# EAGLE design WiFiHumi (EAGLE 7.2.0)
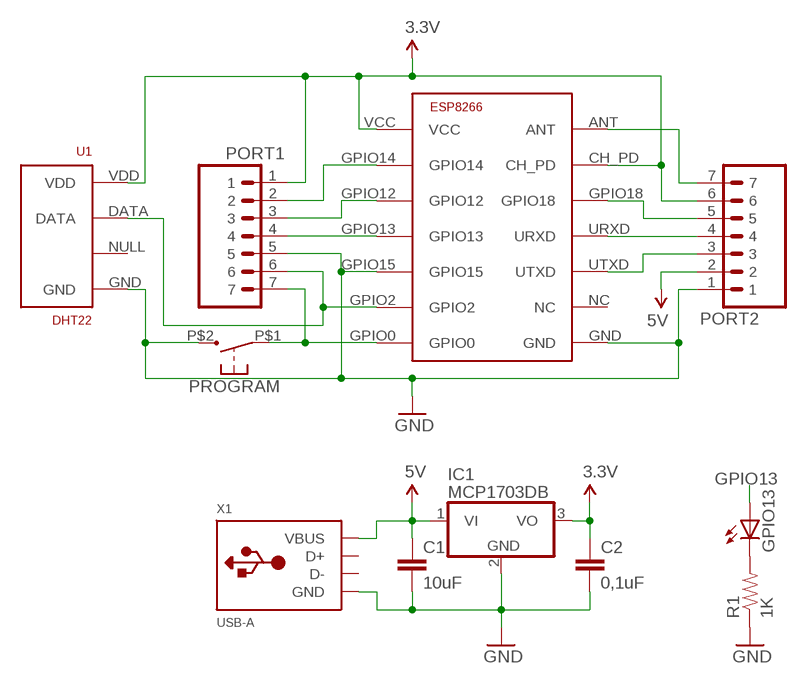
[diagram p0: schematic, sheet 1]

## Parts
C1  10uF  CAP0603-CAP  [0603-CAP]
C2  0,1uF  CAP0603-CAP  [0603-CAP]
GPIO13  LEDCHIPLED_0603  [CHIPLED_0603]
IC1  MCP1703DB  [SOT223]
PORT1  DIPLOCK7-FEMALE  [1X07_FEMALE_LOCK.010]
PORT2  DIPLOCK7-FEMALE  [1X07_FEMALE_LOCK.010]
PROGRAM  OMRON_B3U-1000_TACT_SW  [BC3-1000]
R1  1K  RESISTOR0603-RES  [0603-RES]
U1  DHT22  RHT03_DHT-22_AM2302RA  [RHT03_DHT-22/RA]
U$1  ESP8266  [ESP-03]
X1  USB-A  [MOLEX_480371000]

## Nets
3.3V: C2.1 IC1.3(VO) PORT1.1 PORT2.6 U1.VDD U$1.CH_PD U$1.VCC
5V: C1.1 IC1.1(VI) PORT2.2 X1.1(VBUS)
ANT: PORT2.7 U$1.ANT
GND: C1.2 C2.2 IC1.2(GND) PORT1.5 PORT2.1 PROGRAM.P$2 R1.1 U1.GND U$1.GND U$1.GPIO15 X1.4(GND)
GPIO0: PORT1.7 PROGRAM.P$1 U$1.GPIO0
GPIO02: PORT1.6 U1.DATA U$1.GPIO2
GPIO12: PORT1.3 U$1.GPIO12
GPIO13: GPIO13.A PORT1.4 U$1.GPIO13
GPIO14: PORT1.2 U$1.GPIO14
GPIO18: PORT2.5 U$1.GPIO18
N$1: GPIO13.C R1.2
RXD: PORT2.4 U$1.URXD
TXD: PORT2.3 U$1.UTXD
Unconnected: U1.NULL U$1.NC X1.2(D-) X1.3(D+)

## Library data of the parts
C1 C2 = SparkFun:CAP: Capacitor Standard 0603 ceramic capacitor, and 0.1" leaded capacitor.
GPIO13 = adafruit:LED: LED OSRAM: - CHIPLED LG R971, LG N971, LY N971, LG Q971, LY Q971, LO R971, LY R971 LH N974, LH R974 LS Q976, LO Q976, LY Q976 LO Q996 - Hyper CHIPLED LW Q18S LB Q993, LB Q99A, LB R99A - SideLED LS A670, LO A670, LY A670, LG A670, LP A670 LB A673, LV A673, LT A673, LW A673 LH A674 LY A675 LS A676, LA A676, LO A676, LY A676, LW A676 LS A679, LY A679, LG A679 - Hyper Micro SIDELED® LS Y876, LA Y876, LO Y876, LY Y876 LT Y87S - SmartLED LW L88C, LW L88S LB L89C, LB L89S, LG L890 LS L89K, LO L89K, LY L89K LS L896, LA L896, LO L896, LY L896 - TOPLED LS T670, LO T670, LY T670, LG T670, LP T670 LSG T670, LSP T670, LSY T670, LOP T670, LYG T670 LG T671, LOG T671, LSG T671 LB T673, LV T673, LT T673, LW T673 LH T674 LS T676, LA T676, LO T676, LY T676, LB T676, LH T676, LSB T676, LW T676 LB T67C, LV T67C, LT T67C, LS T67K, LO T67K, LY T67K, LW E67C LS E67B, LA E67B, LO E67B, LY E67B, LB E67C, LV E67C, LT E67C LW T67C LS T679, LY T679, LG T679 LS T770, LO T770, LY T770, LG T770, LP T770 LB T773, LV T773, LT T773, LW T773 LH T774 LS E675, LA E675, LY E675, LS T675 LS T776, LA T776, LO T776, LY T776, LB T776 LHGB T686 LT T68C, LB T68C - Hyper Mini TOPLED® LB M676 - Mini TOPLED Santana® LG M470 LS M47K, LO M47K, LY M47K Source: http://www.osram.convergy.de/
IC1 = linear:MCP1703: 250 mA, 16V, Low Quiescent Current LDO Regulator Source: http://ww1.microchip.com/downloads/en/DeviceDoc/22049b.pdf
PORT1 PORT2 = LockHeader:DIPLOCK7: PIN HEADER
PROGRAM = ModernDevice:OMRON_B3U-1000_TACT_SW
R1 = SparkFun:RESISTOR: Resistor Basic schematic elements and footprints for 0603, 1206, and PTH resistors.
U1 = RHT03_DHT-22_AM2302:RHT03_DHT-22_AM2302: RHT03 / DHT-22 / AM2302 Packages and symbol for the RHT03 / DHT-22 relative humidity and temperature sensor. Note: The AM2302 is a wired version of the DHT-22 which typically requires less clearance and is thus provided as a separate package.; PROD_ID: SEN-10167
U$1 = ESP8266:ESP8266: low cost Wifi to Serial Module
X1 = adafruit:USB-A: USB type A 'plug' Used for things that can directly connect to a USB port, say USB key

## Board
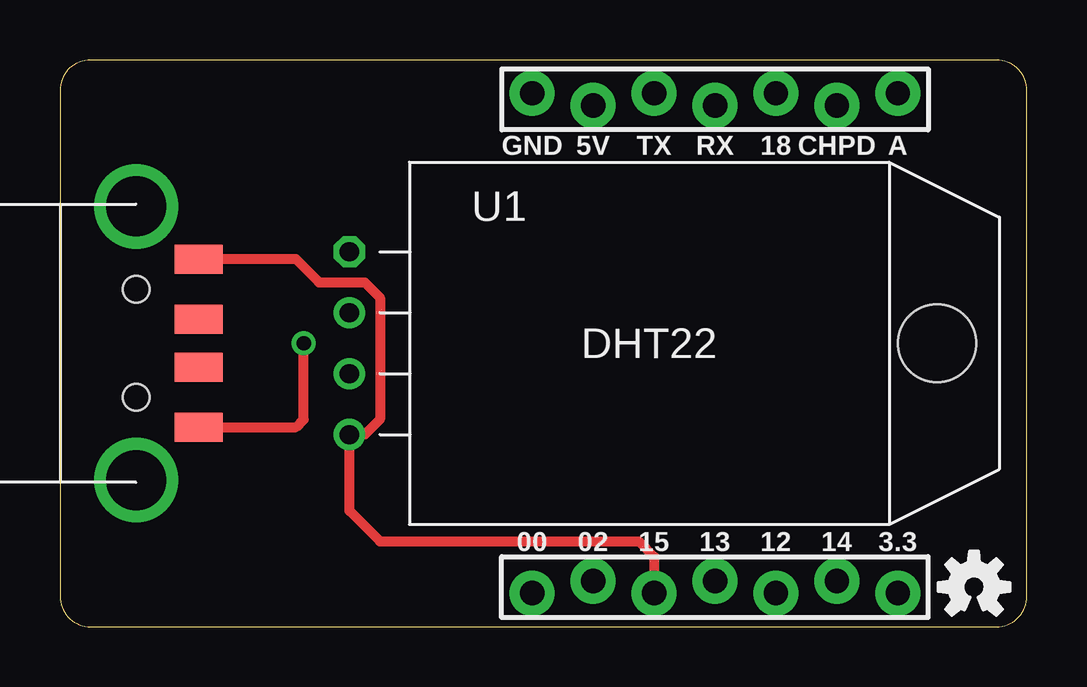
[diagram p1: board, top side]
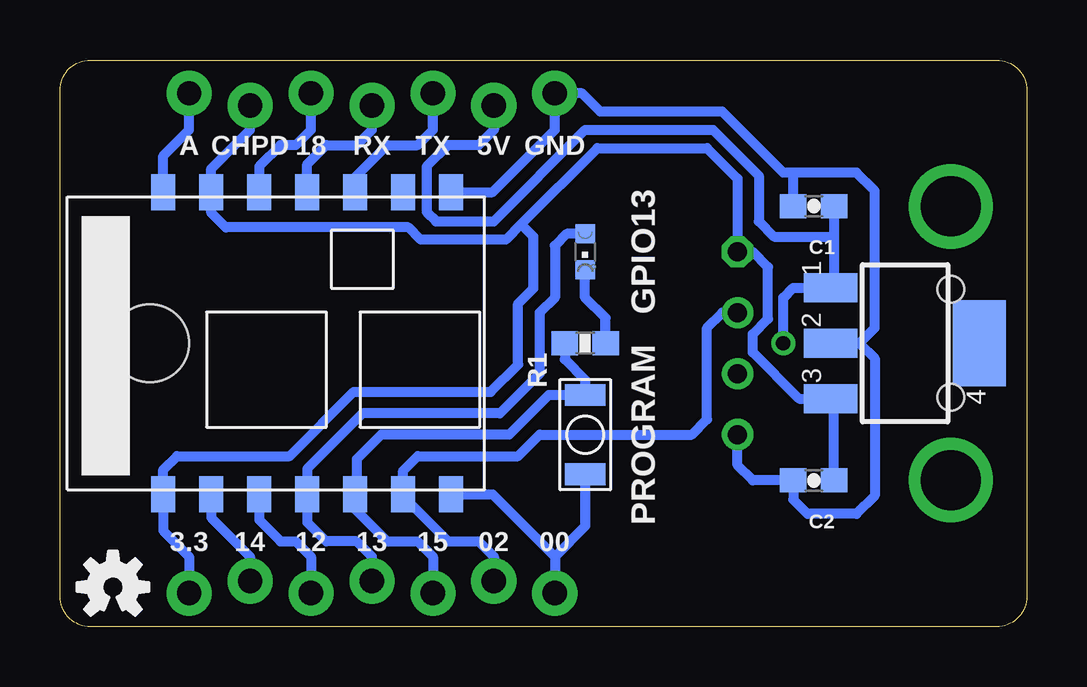
[diagram p2: board, bottom side, seen from below]

Size 40.31 x 23.61 mm. Coordinates in mm from the lower left corner, seen from the top.
Outline: 0,22.34 0,1.27 arc90 1.27,0 39.04,0 arc90 40.31,1.27 40.31,22.34 arc90 39.04,23.61 1.27,23.61 arc90 0,22.34
Copper layers (1*16): Top 0.035mm / dielectric 1.5mm / Bottom 0.035mm
Design rules "default": minimum track width 10mil, minimum drill 24mil, track to track 8mil, track to pad 8mil, pad to pad 8mil, via to via 8mil, smd to smd 8mil, copper to edge 40mil, drill to drill 8mil, minimum pad ring 10mil, minimum via ring 8mil, stop-mask expansion 4mil, vias tented up to drill 0mil, thermal gap 10mil

### Footprints (pad centres in the part's own frame; a part is rotated, then mirrored left to right if it is on the bottom)
0603-CAP = smd 1.1 x 1: 1 -0.85,0; 2 0.85,0
CHIPLED_0603 = smd 0.8 x 0.8: A 0,-0.75; C 0,0.75
SOT223 = smd 1.219 x 2.235: 1 -2.311,-3.099; 2 0,-3.099; 3 2.311,-3.099 | smd 3.6 x 2.2: 4 0,3.099
1X07_FEMALE_LOCK.010 = drill 1.016 pad 1.88: 1 0,0.254; 2 2.54,-0.254; 3 5.08,0.254; 4 7.62,-0.254; 5 10.16,0.254; 6 12.7,-0.254; 7 15.24,0.254
BC3-1000 = smd 0.9 x 1.7: P$1 1.65,0; P$2 -1.65,0
0603-RES = smd 1.1 x 1: 1 -0.85,0; 2 0.85,0
RHT03_DHT-22/RA = drill 0.8: DATA -1.27,0; GND 3.81,0; NULL 1.27,0 | drill 0.8 octagon: VDD -3.81,0 | hole 3.25: 0,24.5
ESP-03 = smd 1 x 1.5: ANT 4,6.3; CH_PD 6,6.3; GND 16,6.3; GPIO0 16,-6.3; GPIO2 14,-6.3; GPIO12 8,-6.3; GPIO13 10,-6.3; GPIO14 6,-6.3; GPIO15 12,-6.3; GPIO18 8,6.3; NC 14,6.3; URXD 10,6.3; UTXD 12,6.3; VCC 4,-6.3
MOLEX_480371000 = smd 1.2 x 2: 1 3.5,2.6; 2 1,2.6; 3 -1,2.6; 4 -3.5,2.6 | drill 2.5: M1 -5.7,0; M2 5.7,0 | hole 1.1: -2.25,0; 2.25,0

### Placement (x,y rotation side)
C1  8.89,17.53 180 bottom
C2  8.89,6.1 180 bottom
GPIO13  18.41,15.62 180 bottom
IC1  5.08,11.81 270 bottom
PORT1  34.92,1.65 180 top
PORT2  19.68,21.97 0 top
PROGRAM  18.41,8 270 bottom
R1  18.41,11.81 0 bottom
U1  12.07,11.81 270 top
U$1  40,11.81 0 bottom
U$4  [OSHW-LOGO-S]  38.1,1.65 0 top
U$5  [OSHW-LOGO-S]  38.1,1.65 0 bottom
X1  3.18,11.81 270 top

### Tracks (layer width: path | path; a pad name or v marks a point on that pad's centre or on a via)
3.3V
  Bottom 0.406: C2.1 8.04,9.36 IC1.3 9.5,9.5 11.43,11.43 11.43,12.19 10.79,12.83 10.79,14.99 11.43,15.62 U1.VDD 12.07,18.67 13.34,19.94 17.91,19.94 21.08,16.76 | PORT1.1 34.92,2.92 36,4 U$1.VCC 36,6.54 35.43,7.11 30.73,7.11 28.07,9.78 22.35,9.78 21.21,10.92 21.21,13.46 20.57,14.1 20.57,16.26 21.08,16.76 | U$1.CH_PD 34.24,18.11 34.29,18.16 | U$1.CH_PD 34,19.08 32.38,20.7 PORT2.6 | 21.08,16.76 21.72,16.13 25.27,16.13 25.78,16.64 33.4,16.64 34,17.24 U$1.CH_PD
5V  (via drill 0.6)
  Top 0.406: X1.1 9.84,8.31 10.16,8.64 v10.16,11.81
  Bottom 0.406: C1.1 8.04,16.26 | 8.04,16.26 8.04,14.12 IC1.1 9.75,14.12 10.16,13.72 v10.16,11.81 | PORT2.2 22.23,20.7 22.86,20.07 24.13,20.07 25.02,19.18 25.02,17.27 24.64,16.89 22.23,16.89 18.41,20.7 13.08,20.7 11.18,18.8 11.18,16.89 10.54,16.26 8.04,16.26
ANT
  Bottom 0.406: U$1.ANT 36,19.62 34.92,20.7 PORT2.7
GND
  Top 0.406: X1.4 9.84,15.31 10.79,14.35 12.7,14.35 13.34,13.72 13.34,8.64 12.7,8 U1.GND 12.07,4.83 13.34,3.56 24.13,3.56 24.77,2.92 PORT1.5
  Bottom 0.406: U1.GND 12.07,6.73 11.43,6.1 C2.2 9.74,5.29 9.14,4.7 7.11,4.7 6.35,5.46 6.35,11.18 6.99,11.81 | 6.99,11.81 IC1.2 8.26,11.81 | 6.99,11.81 6.35,12.45 6.35,18.16 7.11,18.92 9.74,18.92 | PORT1.5 24.77,2.92 25.4,3.56 26.67,3.56 28,4.89 U$1.GPIO15 27.94,5.58 27.94,6.98 26.92,8 21.59,8 19.94,9.65 PROGRAM.P$2 18.41,10.29 19.27,11.14 R1.1 | U$1.GND 22.28,18.11 19.68,20.7 PORT2.1 18.54,22.22 17.78,21.46 12.7,21.46 10.16,18.92 9.74,18.92 | C1.2 9.74,18.92
GPIO0
  Bottom 0.406: U$1.GPIO0 22.28,5.51 19.68,2.92 | 19.68,2.92 PORT1.7 | PROGRAM.P$1 18.41,4.19 19.68,2.92
GPIO02
  Bottom 0.406: PORT1.6 22.23,2.92 22.86,3.56 24.13,3.56 26,5.43 U$1.GPIO2 26,6.51 25.4,7.11 21.21,7.11 20.32,8 13.97,8 13.34,8.64 13.34,12.45 12.7,13.08 U1.DATA
GPIO12
  Bottom 0.406: 32,5.08 U$1.GPIO12 32,4.45 31.11,3.56 30.48,3.56 29.84,2.92 PORT1.3
GPIO13
  Bottom 0.406: PORT1.4 27.3,2.92 27.94,3.56 29.21,3.56 30,4.35 U$1.GPIO13 30,6.57 27.69,8.89 21.97,8.89 20.32,10.54 20.32,13.08 19.68,13.72 19.68,15.88 19.19,16.37 GPIO13.A
GPIO14
  Bottom 0.406: U$1.GPIO14 34,4.54 32.38,2.92 PORT1.2
GPIO18
  Bottom 0.406: 32,18.54 U$1.GPIO18 32,19.18 31.11,20.07 30.48,20.07 29.84,20.7 PORT2.5
N$1
  Bottom 0.406: R1.2 17.57,12.87 18.41,13.72 GPIO13.C
RXD
  Bottom 0.406: 30,18 U$1.URXD 30,19.27 29.21,20.07 27.94,20.07 27.3,20.7 PORT2.4
TXD
  Bottom 0.406: U$1.UTXD 28,18.73 26.67,20.07 25.4,20.07 24.77,20.7 PORT2.3

### Text on the board
tNames: GND | 5V | TX | RX | 18 | CHPD | A | 00 | 02 | 15 | 13 | 12 | 14 | 3.3
bNames: GND | 5V | TX | RX | 18 | CHPD | A | A | PROGRAM | 00 | 02 | 15 | 13 | 12 | 14 | 3.3
tValues: Wifi Humidity v1 | taaralabs.eu/wh1
bValues: Wifi Humidity v1 | taaralabs.eu/wh1